# Altium schematic sheet Memoria.SchDoc: CONTROLADORA AIRPOPCORN
size A3; DocumentNumber: 10.00.0025; SheetNumber: 13; SheetTotal: 16
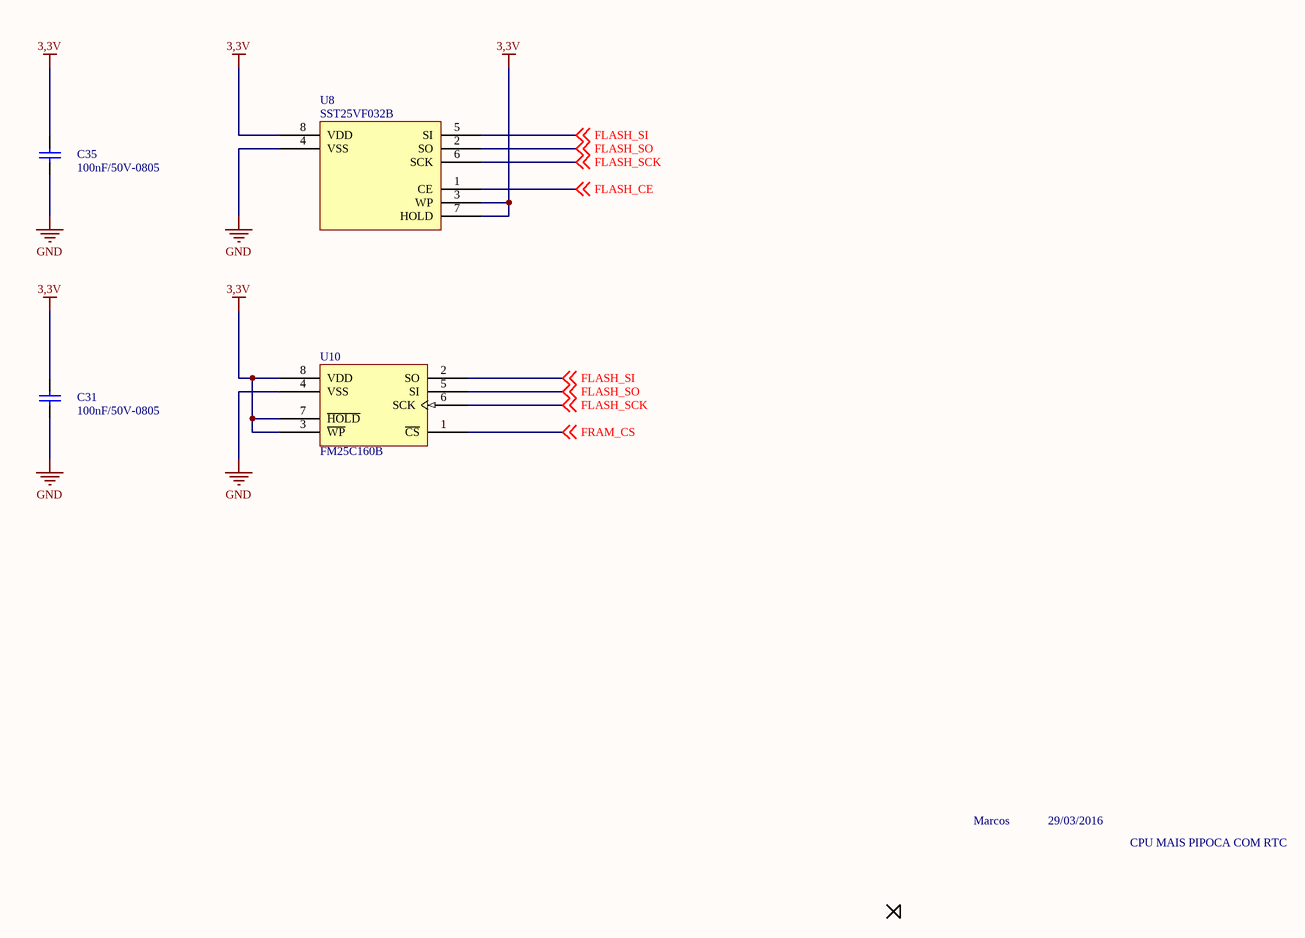
[diagram p0: Memoria.SchDoc]

## Parts
C31  100nF/50V-0805  [0805-REVISADO O]
C35  100nF/50V-0805  [0805-REVISADO O]
U8  SST25VF032B  [SOIC LARGO ATME]
U10  FM25C160B  [SOIC-08]

## Nets
3,3V: C31.2 C35.2 U8.3(WP) U8.7(HOLD) U8.8(VDD) U10.3(~{WP}) U10.7(~{HOLD}) U10.8(VDD)
GND: C31.1 C35.1 U8.4(VSS) U10.4(VSS)
FLASH_CE: U8.1(CE) ; off-sheet FLASH_CE
FLASH_SCK: U8.6(SCK) U10.6(SCK) ; off-sheet FLASH_SCK
FLASH_SI: U8.5(SI) U10.2(SO) ; off-sheet FLASH_SI
FLASH_SO: U8.2(SO) U10.5(SI) ; off-sheet FLASH_SO
FRAM_CS: U10.1(~{CS}) ; off-sheet FRAM_CS

## Notes on the sheet
- Marcos
- 29/03/2016
- CPU MAIS PIPOCA COM RTC
- NOME
- DATA
- PROJETO
- DESCRIÇÃO
- www.quarktee.com.br
- desenho
- verif.
- aprov.
- TAMANHO
- CODIGO
- Todas as informações disponíveis
- não devem ser divulgadas,
- em parte ou todo.
- CIRCUITO IMPRESSO
- MONTAGEM ELETRÔNICA
- A4
- de

## Library data of the parts
C31 C35 = 100nF/50-0805-NPO: ERP: 104.11.005
U8 = SST25VF032B: ERP: FALTA CADASTRAR